# Altium schematic sheet 3_mcu_main.schdoc: Main radio MCU
size A3; DrawnBy: Sara Vega Martinez; Revision: v0.1; SheetNumber: 3; SheetTotal: 6; DesignedBy: André M. P. Mattos
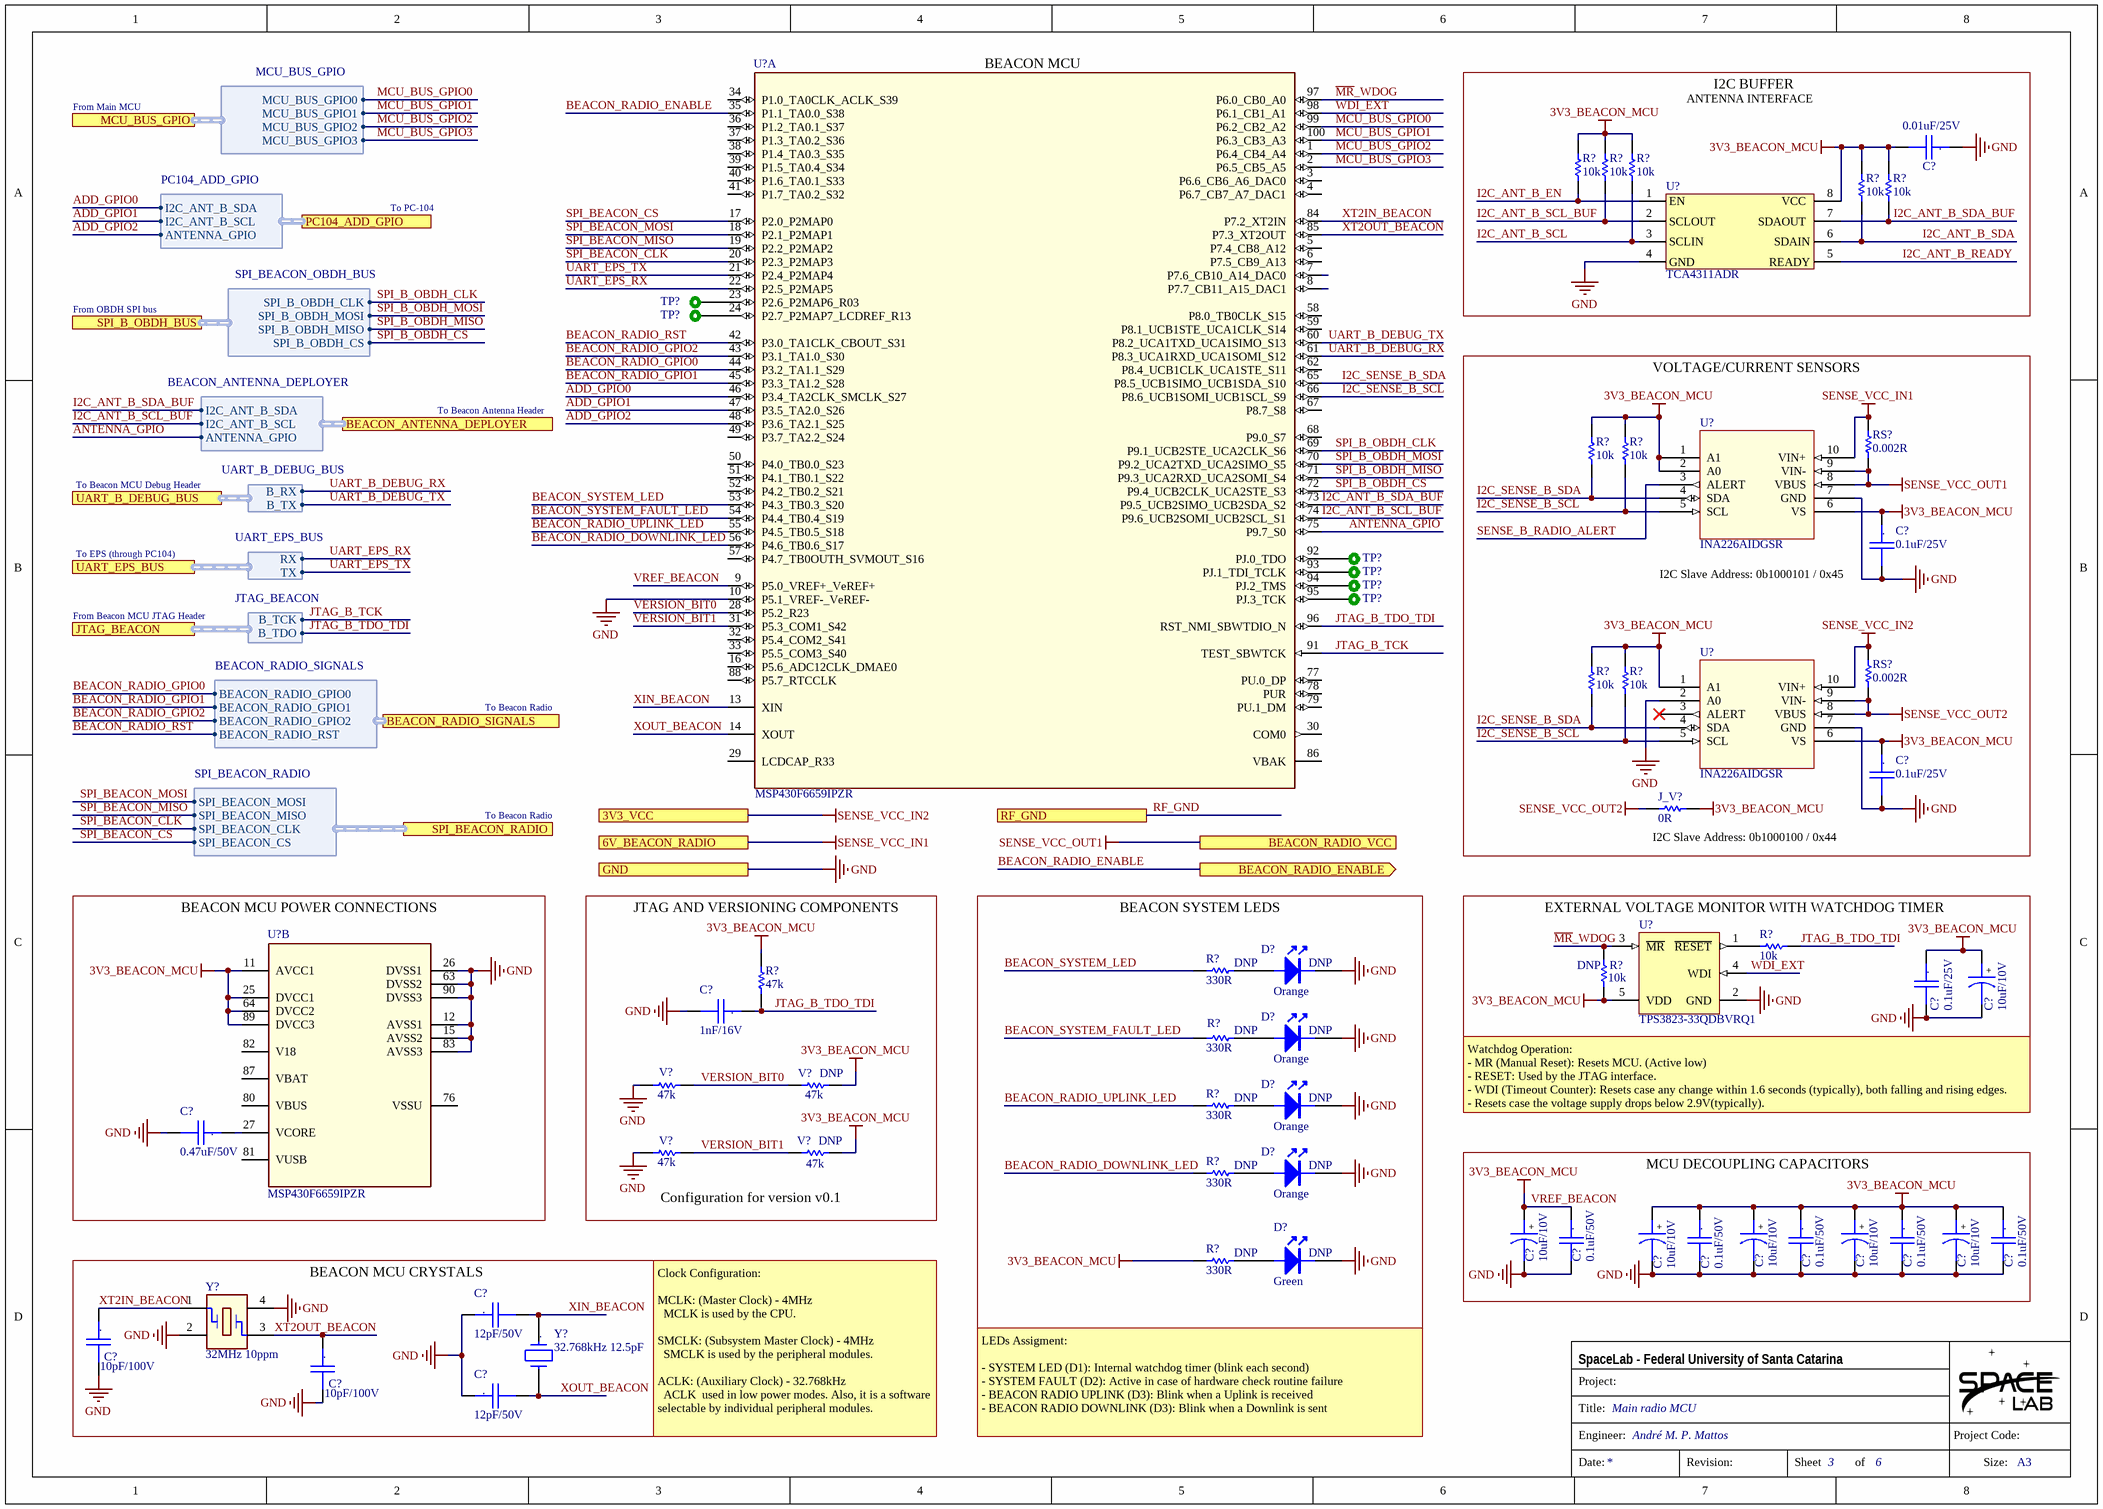
[diagram p0: 3_mcu_main.schdoc]

## Parts
(Parts that share a designator on the sheet are numbered #1, #2 ... from top to bottom, then left to right.)
C?#1  0.01uF/25V  [CC0805]
C?#2  0.1uF/25V  [CC0805]
C?#3  0.1uF/25V  [CC0805]
C?#4  0.1uF/25V  [CC0805]
C?#5  10uF/10V  [CC0805_Tantalum]
C?#6  1nF/16V  [CC0805]
C?#7  0.47uF/50V  [CC0603]
C?#8  10uF/10V  [CC0805_Tantalum]
C?#9  0.1uF/50V  [CC0603]
C?#10  10uF/10V  [CC0805_Tantalum]
C?#11  0.1uF/50V  [CC0603]
C?#12  10uF/10V  [CC0805_Tantalum]
C?#13  0.1uF/50V  [CC0603]
C?#14  10uF/10V  [CC0805_Tantalum]
C?#15  0.1uF/50V  [CC0603]
C?#16  10uF/10V  [CC0805_Tantalum]
C?#17  0.1uF/50V  [CC0603]
C?#18  10pF/100V  [CC0805]
C?#19  12pF/50V  [CC0805]
C?#20  10pF/100V  [CC0805]
C?#21  12pF/50V  [CC0805]
D?#1  Orange  [0805-LED]
D?#2  Orange  [0805-LED]
D?#3  Orange  [0805-LED]
D?#4  Orange  [0805-LED]
D?#5  Green  [0603-LED]
J_V?  0R  [0805]
R?#1  10k  [0805]
R?#2  10k  [0805]
R?#3  10k  [0805]
R?#4  10k  [0805]
R?#5  10k  [0805]
R?#6  10k  [0805]
R?#7  10k  [0805]
R?#8  10k  [0805]
R?#9  10k  [0805]
R?#10  10k  [0805]
R?#11  10k  [0805]
R?#12  47k  [0805]
R?#13  330R  [0805]
R?#14  330R  [0805]
R?#15  330R  [0805]
R?#16  330R  [0805]
R?#17  330R  [0805]
RS?#1  0.002R  [0805]
RS?#2  0.002R  [0805]
TP?#1  TEST_POINT  [TEST_POINT]  (value not drawn)  (no BOM)
TP?#2  TEST_POINT  [TEST_POINT]  (value not drawn)  (no BOM)
TP?#3  TEST_POINT  [TEST_POINT]  (value not drawn)  (no BOM)
TP?#4  TEST_POINT  [TEST_POINT]  (value not drawn)  (no BOM)
TP?#5  TEST_POINT  [TEST_POINT]  (value not drawn)  (no BOM)
TP?#6  TEST_POINT  [TEST_POINT]  (value not drawn)  (no BOM)
U?#1  TCA4311ADR  [SOIC8]
U?#2  MSP430F6659IPZR  [PZ0100A_N]  (part A of 2)
U?#3  INA226AIDGSR  [DGS10]
U?#4  INA226AIDGSR  [DGS10]
U?#5  TPS3823-33QDBVRQ1  [DBV0005A_N]
U?#6  MSP430F6659IPZR  [PZ0100A_N]  (part B of 2)
V?#1  47k  [0805]
V?#2  47k  [0805]
V?#3  47k  [0805]
V?#4  47k  [0805]
Y?#1  32MHz 10ppm  [XTAL_ABM8X]
Y?#2  32.768kHz 12.5pF  [ABS06 0805]

## Blocks framed on the sheet
I2C BUFFER: C?#1 R?#1-R?#5 U?#1
VOLTAGE/CURRENT SENSORS: C?#2 C?#3 J_V? R?#6-R?#9 RS?#1 RS?#2 U?#3 U?#4
BEACON MCU POWER CONNECTIONS: C?#7 U?#6
BEACON SYSTEM LEDS: D?#1-D?#5 R?#13-R?#17
EXTERNAL VOLTAGE MONITOR WITH WATCHDOG TIMER: C?#4 C?#5 R?#10 R?#11 U?#5
MCU DECOUPLING CAPACITORS: C?#8-C?#17
BEACON MCU CRYSTALS: C?#18-C?#21 Y?#1 Y?#2

## Ports
3V3_VCC, 6V_BEACON_RADIO, BEACON_ANTENNA_DEPLOYER (harness BEACON_ANTENNA_DEPLOYER), BEACON_RADIO_ENABLE (out), BEACON_RADIO_SIGNALS (harness BEACON_RADIO_SIGNALS), BEACON_RADIO_VCC, GND, JTAG_BEACON (harness JTAG_BEACON), MCU_BUS_GPIO (harness MCU_BUS_GPIO), PC104_ADD_GPIO (harness PC104_ADD_GPIO), RF_GND, SPI_B_OBDH_BUS (harness SPI_BEACON_OBDH_BUS), SPI_BEACON_RADIO (harness SPI_BEACON_RADIO), UART_B_DEBUG_BUS (harness UART_B_DEBUG_BUS), UART_EPS_BUS (harness UART_EPS_BUS)

## Harnesses
BEACON_ANTENNA_DEPLOYER: ANTENNA_GPIO, I2C_ANT_B_SCL, I2C_ANT_B_SDA
JTAG_BEACON: B_TDO, B_TCK
UART_B_DEBUG_BUS: B_RX, B_TX
UART_EPS_BUS: RX, TX
BEACON_RADIO_SIGNALS: BEACON_RADIO_GPIO2, BEACON_RADIO_RST, BEACON_RADIO_GPIO0, BEACON_RADIO_GPIO1
SPI_BEACON_RADIO: SPI_BEACON_CLK, SPI_BEACON_MISO, SPI_BEACON_MOSI, SPI_BEACON_CS
SPI_BEACON_OBDH_BUS: SPI_B_OBDH_CLK, SPI_B_OBDH_MOSI, SPI_B_OBDH_MISO, SPI_B_OBDH_CS
PC104_ADD_GPIO: ANTENNA_GPIO, I2C_ANT_B_SCL, I2C_ANT_B_SDA
MCU_BUS_GPIO: MCU_BUS_GPIO0, MCU_BUS_GPIO1, MCU_BUS_GPIO2, MCU_BUS_GPIO3

## Nets
GND: C?#1.1 C?#2.2 C?#3.2 C?#4.2 C?#5.2 C?#6.2 C?#7.2 C?#8.2 C?#9.2 C?#10.2 C?#11.2 C?#12.2 C?#13.2 C?#14.2 C?#15.2 C?#16.2 C?#17.2 C?#18.2 C?#19.1 C?#20.2 C?#21.1 D?#1.2(K) D?#2.2(K) D?#3.2(K) D?#4.2(K) D?#5.2(K) U?#1.4(GND) U?#2.10(P5.1_VREF-_VeREF-) U?#3.7(GND) U?#4.2(A0) U?#4.7(GND) U?#5.2(GND) U?#6.12(AVSS1) U?#6.15(AVSS2) U?#6.26(DVSS1) U?#6.63(DVSS2) U?#6.83(AVSS3) U?#6.90(DVSS3) V?#1.2 V?#3.2 Y?#1.2 Y?#1.4 ; port GND
SENSE_VCC_IN1: RS?#1.2 U?#3.10(VIN+) ; port 6V_BEACON_RADIO
SENSE_VCC_IN2: RS?#2.2 U?#4.10(VIN+) ; port 3V3_VCC
SENSE_VCC_OUT1: RS?#1.1 U?#3.8(VBUS) U?#3.9(VIN-) ; port BEACON_RADIO_VCC
SENSE_VCC_OUT2: J_V?.2 RS?#2.1 U?#4.8(VBUS) U?#4.9(VIN-)
VREF_BEACON: C?#1.2 C?#2.1 C?#3.1 C?#4.1 C?#5.1 C?#8.1 C?#9.1 C?#10.1 C?#11.1 C?#12.1 C?#13.1 C?#14.1 C?#15.1 C?#16.1 C?#17.1 J_V?.1 R?#1.1 R?#2.1 R?#3.1 R?#4.1 R?#5.1 R?#6.1 R?#7.1 R?#8.1 R?#9.1 R?#10.1 R?#12.2 R?#17.1 U?#1.8(VCC) U?#2.9(P5.0_VREF+_VeREF+) U?#3.1(A1) U?#3.2(A0) U?#3.6(VS) U?#4.1(A1) U?#4.6(VS) U?#5.5(VDD) U?#6.11(AVCC1) U?#6.25(DVCC1) U?#6.64(DVCC2) U?#6.89(DVCC3) V?#2.1 V?#4.1  [also labelled 3V3_BEACON_MCU]
~{MR}_WDOG: R?#10.2 U?#2.97(P6.0_CB0_A0) U?#5.3(~{MR})
ADD_GPIO0: U?#2.46(P3.4_TA2CLK_SMCLK_S27) ; port PC104_ADD_GPIO.I2C_ANT_B_SDA
ADD_GPIO1: U?#2.47(P3.5_TA2.0_S26) ; port PC104_ADD_GPIO.I2C_ANT_B_SCL
ADD_GPIO2: U?#2.48(P3.6_TA2.1_S25) ; port PC104_ADD_GPIO.ANTENNA_GPIO
ANTENNA_GPIO: U?#2.75(P9.7_S0) ; port BEACON_ANTENNA_DEPLOYER.ANTENNA_GPIO
BEACON_RADIO_DOWNLINK_LED: R?#16.1 U?#2.56(P4.6_TB0.6_S17)
BEACON_RADIO_ENABLE: U?#2.35(P1.1_TA0.0_S38) ; port BEACON_RADIO_ENABLE
BEACON_RADIO_GPIO0: U?#2.44(P3.2_TA1.1_S29) ; port BEACON_RADIO_SIGNALS.BEACON_RADIO_GPIO0
BEACON_RADIO_GPIO1: U?#2.45(P3.3_TA1.2_S28) ; port BEACON_RADIO_SIGNALS.BEACON_RADIO_GPIO1
BEACON_RADIO_GPIO2: U?#2.43(P3.1_TA1.0_S30) ; port BEACON_RADIO_SIGNALS.BEACON_RADIO_GPIO2
BEACON_RADIO_RST: U?#2.42(P3.0_TA1CLK_CBOUT_S31) ; port BEACON_RADIO_SIGNALS.BEACON_RADIO_RST
BEACON_RADIO_UPLINK_LED: R?#15.1 U?#2.55(P4.5_TB0.5_S18)
BEACON_SYSTEM_FAULT_LED: R?#14.1 U?#2.54(P4.4_TB0.4_S19)
BEACON_SYSTEM_LED: R?#13.1 U?#2.53(P4.3_TB0.3_S20)
I2C_ANT_B_EN: R?#1.2 U?#1.1(EN)
I2C_ANT_B_READY: U?#1.5(READY)
I2C_ANT_B_SCL: R?#3.2 U?#1.3(SCLIN)
I2C_ANT_B_SCL_BUF: R?#2.2 U?#1.2(SCLOUT) U?#2.74(P9.6_UCB2SOMI_UCB2SCL_S1) ; port BEACON_ANTENNA_DEPLOYER.I2C_ANT_B_SCL
I2C_ANT_B_SDA: R?#4.2 U?#1.6(SDAIN)
I2C_ANT_B_SDA_BUF: R?#5.2 U?#1.7(SDAOUT) U?#2.73(P9.5_UCB2SIMO_UCB2SDA_S2) ; port BEACON_ANTENNA_DEPLOYER.I2C_ANT_B_SDA
I2C_SENSE_B_SCL: R?#7.2 R?#9.2 U?#2.66(P8.6_UCB1SOMI_UCB1SCL_S9) U?#3.5(SCL) U?#4.5(SCL)
I2C_SENSE_B_SDA: R?#6.2 R?#8.2 U?#2.65(P8.5_UCB1SIMO_UCB1SDA_S10) U?#3.4(SDA) U?#4.4(SDA)
JTAG_B_TCK: U?#2.91(TEST_SBWTCK) ; port JTAG_BEACON.B_TCK
JTAG_B_TDO_TDI: C?#6.1 R?#11.2 R?#12.1 U?#2.96(RST_NMI_SBWTDIO_N) ; port JTAG_BEACON.B_TDO
MCU_BUS_GPIO0: U?#2.99(P6.2_CB2_A2) ; port MCU_BUS_GPIO.MCU_BUS_GPIO0
MCU_BUS_GPIO1: U?#2.100(P6.3_CB3_A3) ; port MCU_BUS_GPIO.MCU_BUS_GPIO1
MCU_BUS_GPIO2: U?#2.1(P6.4_CB4_A4) ; port MCU_BUS_GPIO.MCU_BUS_GPIO2
MCU_BUS_GPIO3: U?#2.2(P6.5_CB5_A5) ; port MCU_BUS_GPIO.MCU_BUS_GPIO3
RF_GND: port RF_GND
SENSE_B_RADIO_ALERT: U?#3.3(ALERT)
SPI_B_OBDH_CLK: U?#2.69(P9.1_UCB2STE_UCA2CLK_S6) ; port SPI_B_OBDH_BUS.SPI_B_OBDH_CLK
SPI_B_OBDH_CS: U?#2.72(P9.4_UCB2CLK_UCA2STE_S3) ; port SPI_B_OBDH_BUS.SPI_B_OBDH_CS
SPI_B_OBDH_MISO: U?#2.71(P9.3_UCA2RXD_UCA2SOMI_S4) ; port SPI_B_OBDH_BUS.SPI_B_OBDH_MISO
SPI_B_OBDH_MOSI: U?#2.70(P9.2_UCA2TXD_UCA2SIMO_S5) ; port SPI_B_OBDH_BUS.SPI_B_OBDH_MOSI
SPI_BEACON_CLK: U?#2.20(P2.3_P2MAP3) ; port SPI_BEACON_RADIO.SPI_BEACON_CLK
SPI_BEACON_CS: U?#2.17(P2.0_P2MAP0) ; port SPI_BEACON_RADIO.SPI_BEACON_CS
SPI_BEACON_MISO: U?#2.19(P2.2_P2MAP2) ; port SPI_BEACON_RADIO.SPI_BEACON_MISO
SPI_BEACON_MOSI: U?#2.18(P2.1_P2MAP1) ; port SPI_BEACON_RADIO.SPI_BEACON_MOSI
UART_B_DEBUG_RX: U?#2.61(P8.3_UCA1RXD_UCA1SOMI_S12) ; port UART_B_DEBUG_BUS.B_RX
UART_B_DEBUG_TX: U?#2.60(P8.2_UCA1TXD_UCA1SIMO_S13) ; port UART_B_DEBUG_BUS.B_TX
UART_EPS_RX: U?#2.22(P2.5_P2MAP5) ; port UART_EPS_BUS.RX
UART_EPS_TX: U?#2.21(P2.4_P2MAP4) ; port UART_EPS_BUS.TX
VERSION_BIT0: U?#2.28(P5.2_R23) V?#1.1 V?#2.2
VERSION_BIT1: U?#2.31(P5.3_COM1_S42) V?#3.1 V?#4.2
WDI_EXT: U?#2.98(P6.1_CB1_A1) U?#5.4(WDI)
XIN_BEACON: C?#19.2 U?#2.13(XIN) Y?#2.1
XOUT_BEACON: C?#21.2 U?#2.14(XOUT) Y?#2.2
XT2IN_BEACON: C?#18.1 U?#2.84(P7.2_XT2IN) Y?#1.1
XT2OUT_BEACON: C?#20.1 U?#2.85(P7.3_XT2OUT) Y?#1.3
NetC?#7_1: C?#7.1 U?#6.27(VCORE)
NetD?#1_1: D?#1.1(A) R?#13.2
NetD?#2_1: D?#2.1(A) R?#14.2
NetD?#3_1: D?#3.1(A) R?#15.2
NetD?#4_1: D?#4.1(A) R?#16.2
NetD?#5_1: D?#5.1(A) R?#17.2
NetR?#11_1: R?#11.1 U?#5.1(~{RESET})
NetTP?#1_1: TP?#1.1 U?#2.23(P2.6_P2MAP6_R03)
NetTP?#2_1: TP?#2.1 U?#2.24(P2.7_P2MAP7_LCDREF_R13)
NetTP?#3_1: TP?#3.1 U?#2.92(PJ.0_TDO)
NetTP?#4_1: TP?#4.1 U?#2.93(PJ.1_TDI_TCLK)
NetTP?#5_1: TP?#5.1 U?#2.94(PJ.2_TMS)
NetTP?#6_1: TP?#6.1 U?#2.95(PJ.3_TCK)

Not connected (* = marked no-connect by the designer): U?#2 3(P6.6_CB6_A6_DAC0) 4(P6.7_CB7_A7_DAC1) 5(P7.4_CB8_A12) 6(P7.5_CB9_A13) 7(P7.6_CB10_A14_DAC0) 8(P7.7_CB11_A15_DAC1) 16(P5.6_ADC12CLK_DMAE0) 29(LCDCAP_R33) 30(COM0) 32(P5.4_COM2_S41) 33(P5.5_COM3_S40) 34(P1.0_TA0CLK_ACLK_S39) 36(P1.2_TA0.1_S37) 37(P1.3_TA0.2_S36) 38(P1.4_TA0.3_S35) 39(P1.5_TA0.4_S34) 40(P1.6_TA0.1_S33) 41(P1.7_TA0.2_S32) 49(P3.7_TA2.2_S24) 50(P4.0_TB0.0_S23) 51(P4.1_TB0.1_S22) 52(P4.2_TB0.2_S21) 57(P4.7_TB0OUTH_SVMOUT_S16) 58(P8.0_TB0CLK_S15) 59(P8.1_UCB1STE_UCA1CLK_S14) 62(P8.4_UCB1CLK_UCA1STE_S11) 67(P8.7_S8) 68(P9.0_S7) 77(PU.0_DP) 78(PUR) 79(PU.1_DM) 86(VBAK) 88(P5.7_RTCCLK); U?#4 3(ALERT)*; U?#6 76(VSSU) 80(VBUS) 81(VUSB) 82(V18) 87(VBAT)

## Notes on the sheet
- From Main MCU
- (near U?#2) BEACON MCU
- ANTENNA INTERFACE
- To PC-104
- From OBDH SPI bus
- To Beacon Antenna Header
- To Beacon MCU Debug Header
- To EPS (through PC104)
- I2C Slave Address: 0b1000101 / 0x45
- From Beacon MCU JTAG Header
- To Beacon Radio
- (near J_V?) I2C Slave Address: 0b1000100 / 0x44
- (near R?#12) JTAG AND VERSIONING COMPONENTS
- (near R?#13) DNP
- (near D?#1) DNP
- (near R?#10) DNP
- (near R?#14) DNP
- (near D?#2) DNP
- (near V?#2) DNP
- (near R?#15) DNP
- (near D?#3) DNP
- (near C?#4) Watchdog Operation:
  - MR (Manual Reset): Resets MCU. (Active low)
  - RESET: Used by the JTAG interface.
  - WDI (Timeout Counter): Resets case any change within 1.6 seconds (typically), both falling and rising edges.
  - Resets case the voltage supply drops below 2.9V(typically).
- (near V?#4) DNP
- (near R?#16) DNP
- (near D?#4) DNP
- (near V?#4) Configuration for version v0.1
- (near R?#17) DNP
- (near D?#5) DNP
- Clock Configuration:
  MCLK: (Master Clock) - 4MHz
  MCLK is used by the CPU.
  SMCLK: (Subsystem Master Clock) - 4MHz
  SMCLK is used by the peripheral modules.
  ACLK: (Auxiliary Clock) - 32.768kHz
  ACLK  used in low power modes. Also, it is a software selectable by individual peripheral modules.
- LEDs Assigment:
  - SYSTEM LED (D1): Internal watchdog timer (blink each second)
  - SYSTEM FAULT (D2): Active in case of hardware check routine failure
  - BEACON RADIO UPLINK (D3): Blink when a Uplink is received
  - BEACON RADIO DOWNLINK (D3): Blink when a Downlink is sent
- Project:
- SpaceLab - Federal University of Santa Catarina
- Title:
- Engineer:
- Project Code:
- Date:
- Revision:
- Sheet
- of
- Size:
- A3
- (in symbol Cap_Cer_X7R_0.1uF_25V_0805) .
- (in symbol Cap_Cer_X7R_0.1uF_50V_0603) .
- (in symbol Cap_Cer_X7R_0.01uF_50V_0805) .
- (in symbol Cap_Cer_X7R_0.47uF_50V_0603) .
- (in symbol Cap_Cer_X7R_1nF_16V_0603) .
- (in symbol Cap_Cer_X7R_10pF_100V_0805) .
- (in symbol Cap_Cer_X7R_12pF_50V_0805) .
- (in symbol Cap_Tant_SMD_10uF_6V3_0805) +
- (in symbol Cap_Tant_SMD_10uF_10V_0805) +
- (in symbol Xtal_32.768kHz_12pF_2_SMD) .

## Library data of the parts
C?#1 = Cap_Cer_X7R_0.01uF_50V_0805: CAP CER 0.01uF 25V 10% X7R 0805; Partnumber: CL21B103KAANNNC; NCM: 8532.24.10
C?#2-C?#4 = Cap_Cer_X7R_0.1uF_25V_0805: CAP CER 0.1UF 25V 10% X7R 0805; Partnumber: CC0805KRX7R8BB104; NCM: 8532.24.10
C?#5 = Cap_Tant_SMD_10uF_10V_0805: CAP Tantalum 10uF 10V 20% 0805; Partnumber: TPSP106M010R2000; NCM: 8532.21.11
C?#6 = Cap_Cer_X7R_1nF_16V_0603: CAP CER 1nF 16V 0603 5%; Partnumber: C0603X102J4RECAUTO; NCM: 8532.24.10
C?#7 = Cap_Cer_X7R_0.47uF_50V_0603: CAP CER 0.47UF 50V 10% X7R 0603; Partnumber: C1608X7R1H474K080AE; NCM: 8532.24.10
C?#8 C?#10 C?#12 C?#14 C?#16 = Cap_Tant_SMD_10uF_6V3_0805: CAP Tantalum 10uF 6.3V 10% 0805; Partnumber: TPSR106K006R1000; NCM: 8532.21.11
C?#9 C?#11 C?#13 C?#15 C?#17 = Cap_Cer_X7R_0.1uF_50V_0603: CAP CER 0.1UF 50V 10% X7R 0603; Partnumber: GRM188R71H104KA93D; NCM: 8532.24.10
C?#18 C?#20 = Cap_Cer_X7R_10pF_100V_0805: CAP CER 10pF 100V 0805; Partnumber: 08051A100FAT2A; NCM: 8532.24.10
C?#19 C?#21 = Cap_Cer_X7R_12pF_50V_0805: CAP CER 12pF 50V 0805; Partnumber: CL21C120FBANNNC; NCM: 8532.24.10
D?#1-D?#4 = LED/R_0603: SMD Orange LED; Partnumber: LTST-C170KFKT; NCM: 8541.40.21
D?#5 = LED/G_0603: SMD Green LED; Partnumber: 150060VS75000; NCM: 8541.40.21
J_V? = R0R_JUMPER_1/16W_0805: RES 0R OHM 1/16W JUMPER 0805; Partnumber: CRCW08050000Z0EA; NCM: 8533.21.20
R?#1-R?#11 = R10k_1%_1/8W_0805: RES 10K OHM 1/8W 1%  0805; Partnumber: CRCW080510K0FKEA; NCM: 8533.21.20
R?#12 V?#1-V?#4 = R27_5%_1/10W_0805: RES 47k OHM 1/10W 1% 0805; Partnumber: RC0805FR-0747KL; NCM: 8533.21.20
R?#13-R?#17 = R330R_1%_1/4W_0805: RES 330R OHM 1/4W 1% 0805; Partnumber: RC0805FR-07330RL; NCM: 8533.21.20
RS?#1 RS?#2 = R0.002R_3%_0.5W_0805: Current Sense Resistors - SMD 0.002 ohm 3% 0.5W Current Sense; Partnumber: LVT08R0020HER
TP?#1-TP?#6 = TEST_POINT: Test point
U?#1 = TCA4311ADR: IC SIGNAL BUFFER I2C 8SOIC; Partnumber: TCA4311ADR
U?#2 U?#6 = MSP430F6659IPZR: Imported; Manufacturer: Texas Instruments; CompType: IC; PIN_COUNT: 100; Application_BuildNumber: *; PartNumber: MSP430F6659IPZR; Alternate PartNumber: MSP430F6659IPZ; PackageReference: PZ0100A; MountType: SMT; RoHS: Y; RefDes: RefDes; Type: DEV; Value: Value
U?#3 U?#4 = INA226AIDGSR: High-Side Measurement, Bi-Directional Current/Power Monitor w/I2C Interface; Manufacturer: Texas Instruments; GENERIC_PART_NUMBER: INA226; INDUSTRY_STD_PKG_TYPE: MSOP; FAMILY_NAME: CURRENT SHUNT MONITOR; PIN_COUNT: 10; PACKAGE_DESIGNATOR: DGS; Datasheet_URL: http://www.ti.com/lit/gpn/INA226; Vendor: Texas Instruments; Manufacturer_Part_Number: INA226AIDGSR; Copyright: Copyright (C) 2018 Accelerated Designs. All rights reserved; RefDes: RefDes; Type: DEV
U?#5 = CMP-0338-00011-2: Processor Supervisory Circuit, 1 Supply Monitored, -40 to 85 degC, 5-Pin SOT-23 (DBV), Green (RoHS & no Sb/Br); Manufacturer: Texas Instruments; Iq: 15 uA Typ.; Threshold Voltage: 2.93 V Typ.; Watchdog Timer WDI: 0.2 s; VCC: 1.1 V Min.; Reset Threshold Accuracy: 2.4%; Rating: Catalog; Time Delay: 25 ms; # of Supplies Monitored: 1; Output Driver Type / Reset Output: Active-low, Push-pull; Packing: Tape and Reel; ComponentLink1Description: Manufacturer URL; RoHS: TRUE; PackageDescription: 5-Pin Plastic Small Outline, Body 1.6 x 2.9 mm, Pitch 0.95 mm; Mounting Technology: Surface Mount; ComponentLink1URL: www.ti.com; PackageReference: DBV0005A; ComponentLink3URL: http://www.ti.com/lit/ml/mpds018j/mpds018j.pdf; ComponentLink3Description: Package Specification; PartNumber: TPS3823-33QDBVRQ1; DatasheetVersion: SLVS165J; ComponentLink2Description: Datasheet; PackageVersion: 4073253-4/L; ComponentLink2URL: http://www.ti.com/lit/ds/symlink/tps3820-33.pdf; Operating Temperature Range: -40 to 85 degC
Y?#1 = XTAL_32MHz_SMD_4-SMD: 32MHz ±10ppm Crystal 10pF 60 Ohm -40°C ~ 125°C; Partnumber: ABM8X-102-32.000MHZ-T; NCM: 8541.60.10
Y?#2 = Xtal_32.768kHz_12pF_2_SMD: 32.768kHz ±20ppm Crystal 12.5pF 70 kOhm -40°C ~ 125°C; Partnumber: ECS-.327-12.5-34S-TR; NCM: 8541.60.10